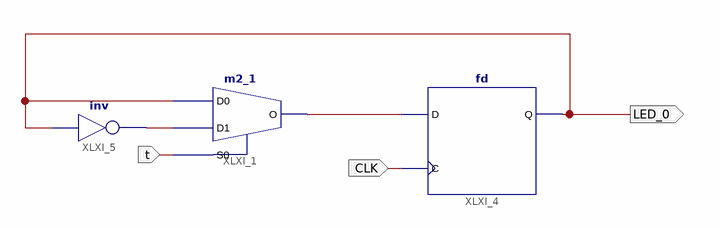
[diagram p0: schematic sheet 1]
// Xilinx ISE schematic Biestable_T.sch (artix7) as structural Verilog: 3 symbols, 3 ports
module Biestable_T (
  input  t,
  input  CLK,
  output LED_0
);

  wire XLXN_2, XLXN_3;

  m2_1 XLXI_1 (.D0(LED_0), .D1(XLXN_3), .S0(t), .O(XLXN_2));
  fd XLXI_4 (.C(CLK), .D(XLXN_2), .Q(LED_0));
  not XLXI_5 (XLXN_3, LED_0);
endmodule
